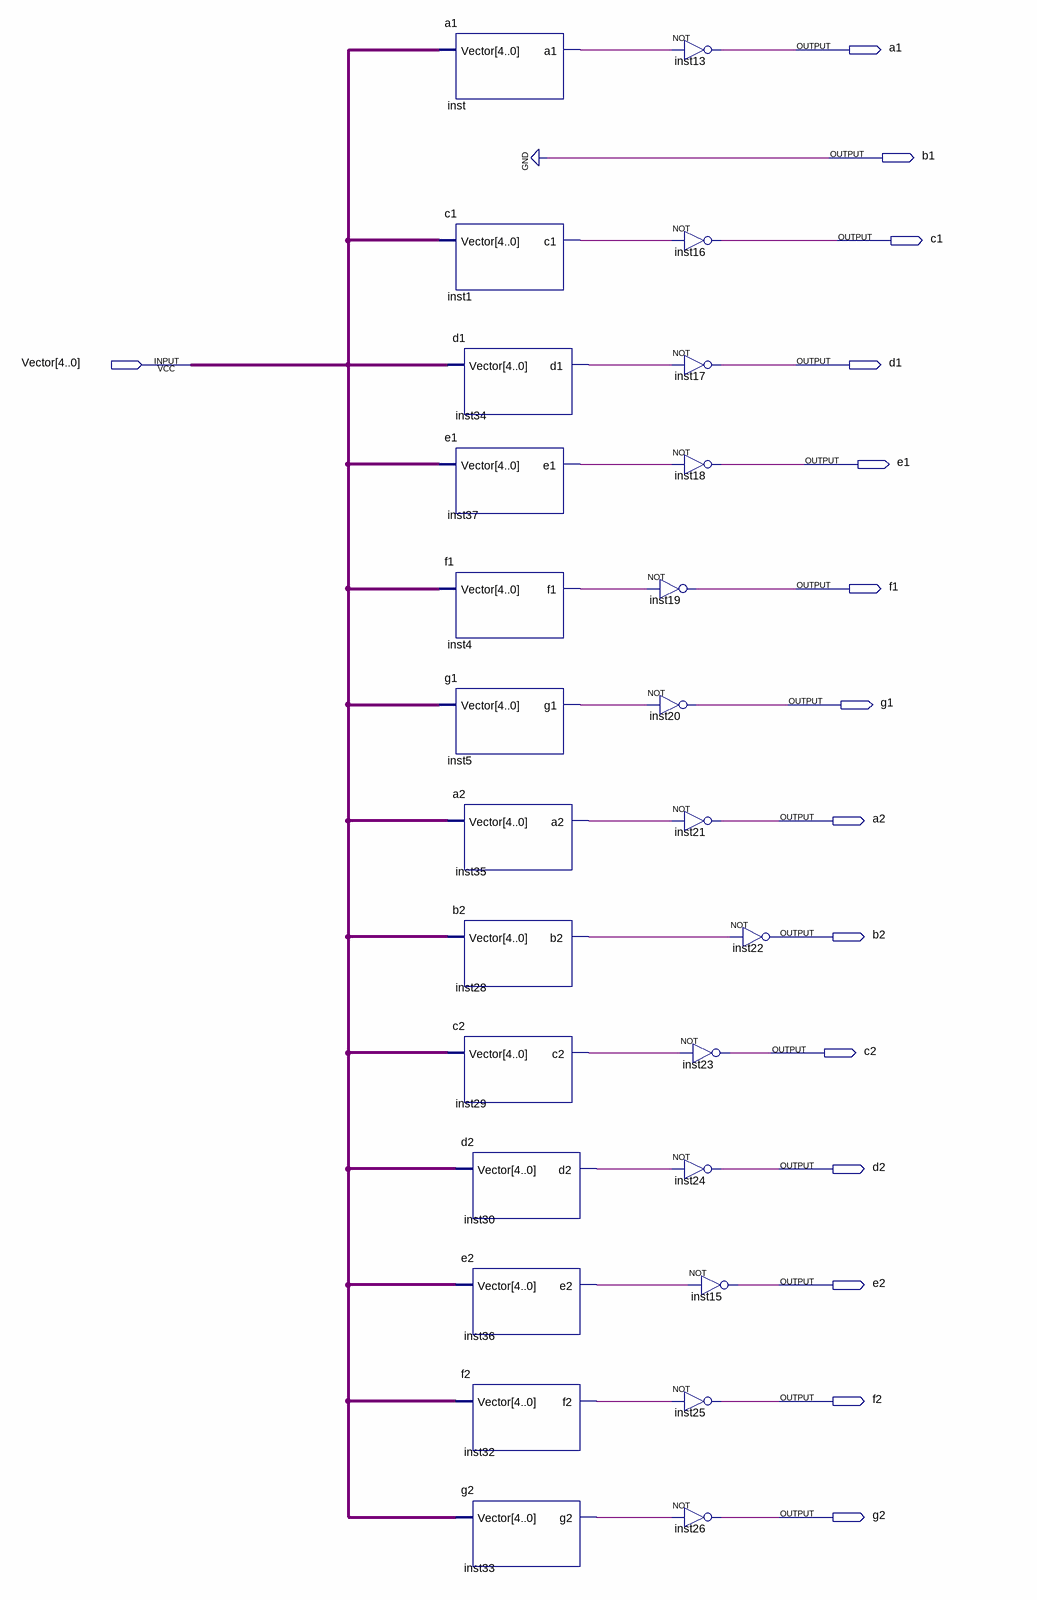
[diagram p0: schematic sheet]
// Quartus schematic decodificador_da_dor.bdf as structural Verilog: 26 symbols, 15 pins
module decodificador_da_dor (
  input  [4:0] Vector,
  output a1,
  output b1,
  output c1,
  output d1,
  output e1,
  output f1,
  output g1,
  output a2,
  output b2,
  output c2,
  output d2,
  output e2,
  output f2,
  output g2
);

  wire inst1_c1, inst4_f1, inst5_g1, inst28_b2, inst29_c2, inst30_d2, inst32_f2, inst33_g2, inst34_d1,
       inst35_a2, inst36_e2, inst37_e1, inst_a1;

  a1 inst (.Vector(Vector), .a1(inst_a1));
  c1 inst1 (.Vector(Vector), .c1(inst1_c1));
  d1 inst34 (.Vector(Vector), .d1(inst34_d1));
  e1 inst37 (.Vector(Vector), .e1(inst37_e1));
  f1 inst4 (.Vector(Vector), .f1(inst4_f1));
  g1 inst5 (.Vector(Vector), .g1(inst5_g1));
  a2 inst35 (.Vector(Vector), .a2(inst35_a2));
  b2 inst28 (.Vector(Vector), .b2(inst28_b2));
  c2 inst29 (.Vector(Vector), .c2(inst29_c2));
  d2 inst30 (.Vector(Vector), .d2(inst30_d2));
  e2 inst36 (.Vector(Vector), .e2(inst36_e2));
  f2 inst32 (.Vector(Vector), .f2(inst32_f2));
  g2 inst33 (.Vector(Vector), .g2(inst33_g2));
  not inst13 (a1, inst_a1);
  not inst16 (c1, inst1_c1);
  not inst17 (d1, inst34_d1);
  not inst18 (e1, inst37_e1);
  not inst19 (f1, inst4_f1);
  not inst20 (g1, inst5_g1);
  not inst21 (a2, inst35_a2);
  not inst24 (d2, inst30_d2);
  not inst25 (f2, inst32_f2);
  not inst26 (g2, inst33_g2);
  not inst22 (b2, inst28_b2);
  not inst23 (c2, inst29_c2);
  not inst15 (e2, inst36_e2);

  assign b1 = 1'b0;
endmodule
